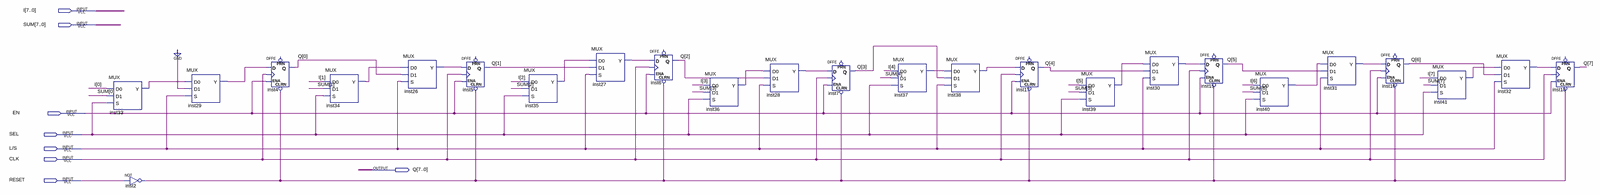
[diagram p0: schematic sheet, whole]
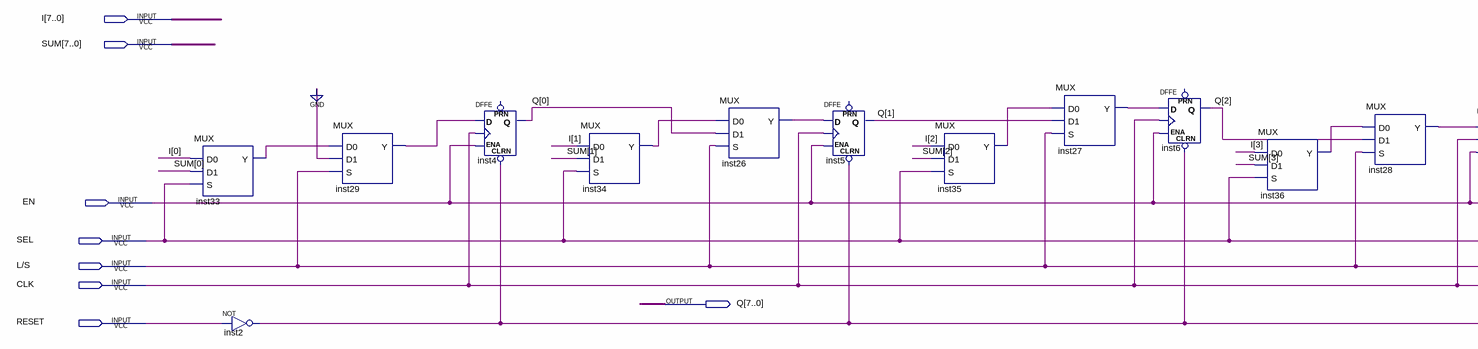
[diagram p1: schematic sheet, left part]
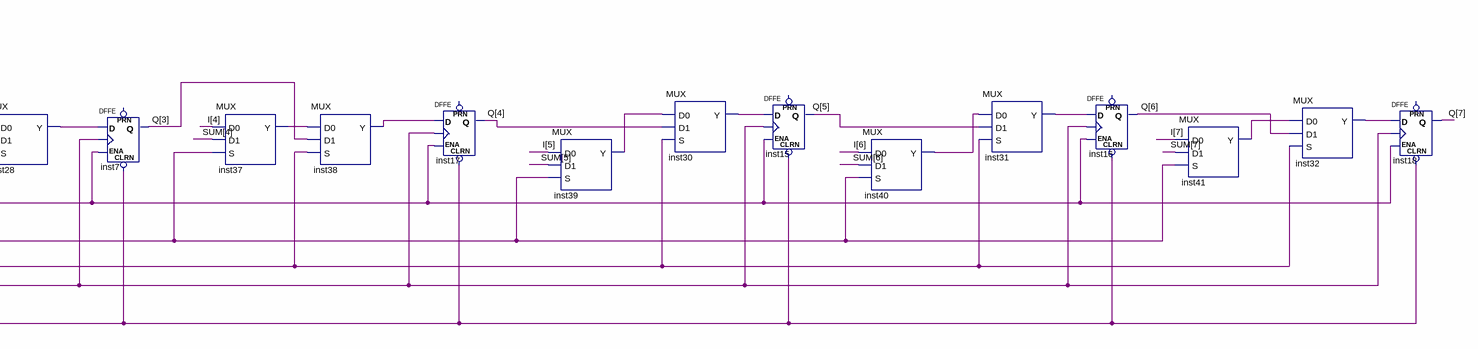
[diagram p2: schematic sheet, right part]
// Quartus schematic REGISTER.bdf as structural Verilog: 25 symbols, 8 pins
module REGISTER (
  input  [7:0] I,
  input  [7:0] SUM,
  input  EN,
  input  SEL,
  input  \L/S ,
  input  CLK,
  input  RESET,
  output [7:0] Q
);

  wire inst2_out, inst26_y, inst27_y, inst28_y, inst29_y, inst30_y, inst31_y, inst32_y, inst33_y, inst34_y,
       inst35_y, inst36_y, inst37_y, inst38_y, inst39_y, inst40_y, inst41_y;

  MUX inst33 (.D0(I[0]), .D1(SUM[0]), .S(SEL), .Y(inst33_y));
  not inst2 (inst2_out, RESET);
  MUX inst29 (.D0(inst33_y), .D1(1'b0), .S(\L/S ), .Y(inst29_y));
  DFFE inst4 (.CLRN(inst2_out), .D(inst29_y), .CLK(CLK), .ENA(EN), .Q(Q[0]));  // open: PRN
  MUX inst34 (.D0(I[1]), .D1(SUM[1]), .S(SEL), .Y(inst34_y));
  MUX inst26 (.D0(inst34_y), .D1(Q[0]), .S(\L/S ), .Y(inst26_y));
  DFFE inst5 (.CLRN(inst2_out), .D(inst26_y), .CLK(CLK), .ENA(EN), .Q(Q[1]));  // open: PRN
  MUX inst35 (.D0(I[2]), .D1(SUM[2]), .S(SEL), .Y(inst35_y));
  MUX inst27 (.D0(inst35_y), .D1(Q[1]), .S(\L/S ), .Y(inst27_y));
  DFFE inst6 (.CLRN(inst2_out), .D(inst27_y), .CLK(CLK), .ENA(EN), .Q(Q[2]));  // open: PRN
  MUX inst36 (.D0(I[3]), .D1(SUM[3]), .S(SEL), .Y(inst36_y));
  MUX inst28 (.D0(inst36_y), .D1(Q[2]), .S(\L/S ), .Y(inst28_y));
  DFFE inst7 (.CLRN(inst2_out), .D(inst28_y), .CLK(CLK), .ENA(EN), .Q(Q[3]));  // open: PRN
  MUX inst37 (.D0(I[4]), .D1(SUM[4]), .S(SEL), .Y(inst37_y));
  MUX inst38 (.D0(inst37_y), .D1(Q[3]), .S(\L/S ), .Y(inst38_y));
  DFFE inst17 (.CLRN(inst2_out), .D(inst38_y), .CLK(CLK), .ENA(EN), .Q(Q[4]));  // open: PRN
  MUX inst39 (.D0(I[5]), .D1(SUM[5]), .S(SEL), .Y(inst39_y));
  MUX inst30 (.D0(inst39_y), .D1(Q[4]), .S(\L/S ), .Y(inst30_y));
  DFFE inst15 (.CLRN(inst2_out), .D(inst30_y), .CLK(CLK), .ENA(EN), .Q(Q[5]));  // open: PRN
  MUX inst40 (.D0(I[6]), .D1(SUM[6]), .S(SEL), .Y(inst40_y));
  MUX inst31 (.D0(inst40_y), .D1(Q[5]), .S(\L/S ), .Y(inst31_y));
  DFFE inst16 (.CLRN(inst2_out), .D(inst31_y), .CLK(CLK), .ENA(EN), .Q(Q[6]));  // open: PRN
  MUX inst41 (.D0(I[7]), .D1(SUM[7]), .S(SEL), .Y(inst41_y));
  MUX inst32 (.D0(inst41_y), .D1(Q[6]), .S(\L/S ), .Y(inst32_y));
  DFFE inst18 (.CLRN(inst2_out), .D(inst32_y), .CLK(CLK), .ENA(EN), .Q(Q[7]));  // open: PRN
endmodule
